# EAGLE design lipo (EAGLE 5.11)
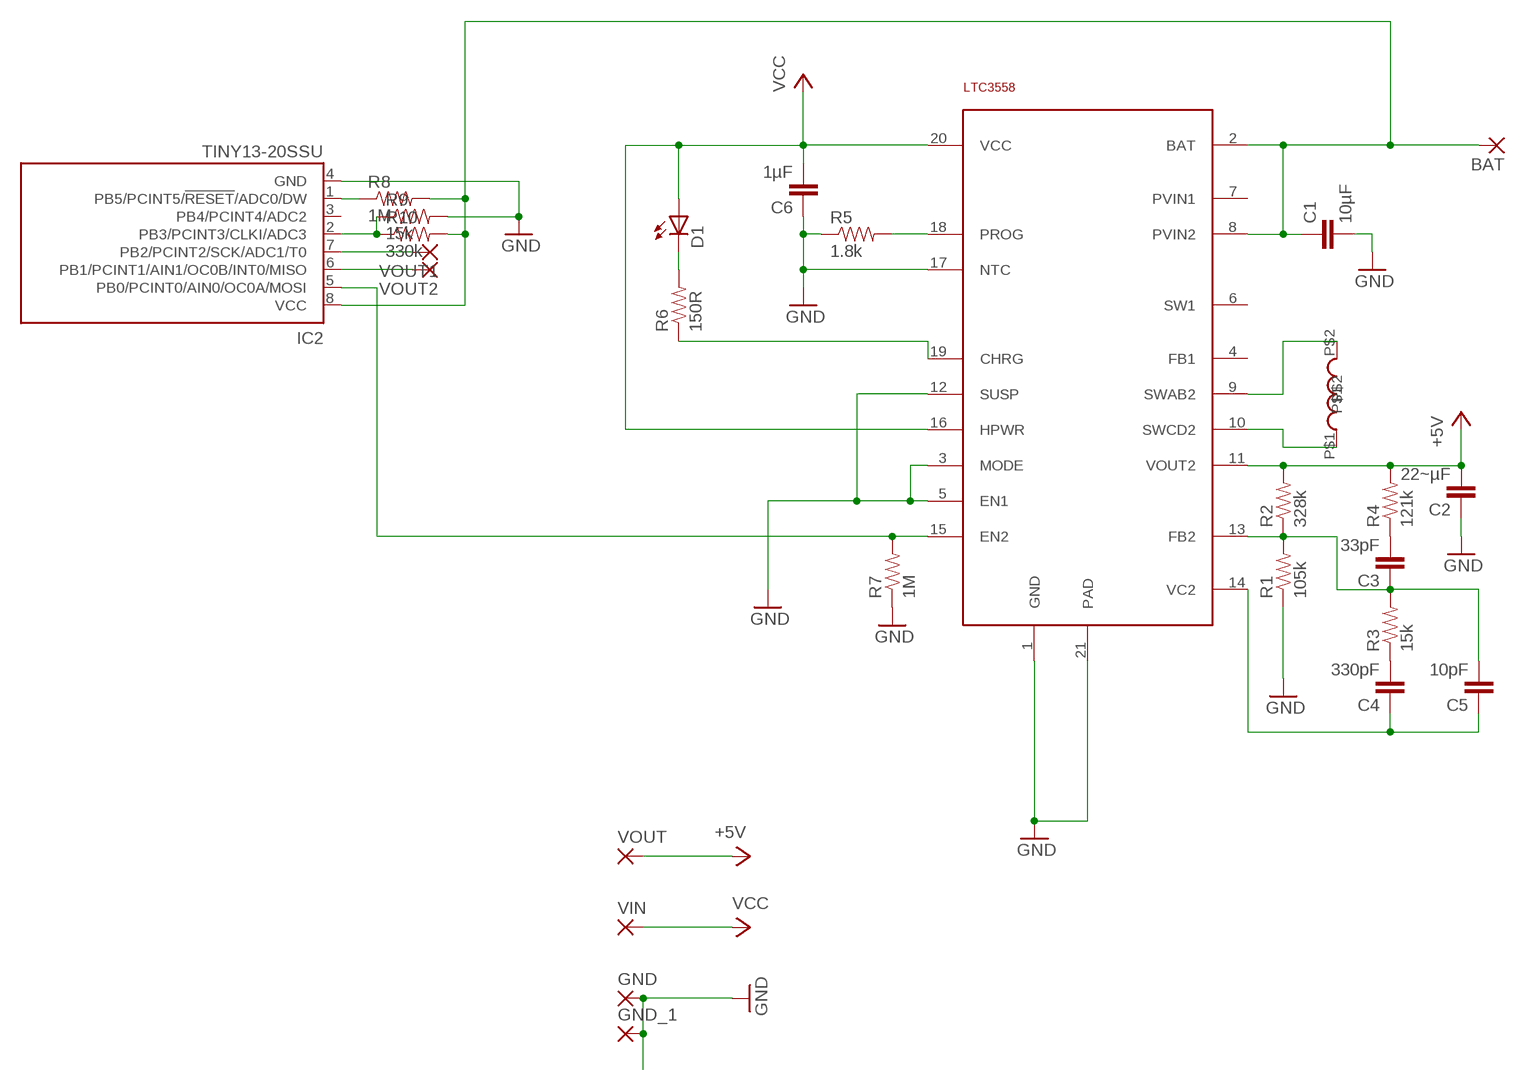
[diagram p0: schematic, sheet 1]

## Parts
BAT  SMD5  [SMD2,54-5,08]
C1  10µF  CAP0805  [0805]
C2  22~µF  CAP0805  [0805]
C3  33pF  CAP0805  [0805]
C4  330pF  CAP0805  [0805]
C5  10pF  CAP0805  [0805]
C6  1µF  CAP0805  [0805]
D1  LEDCHIPLED_0805  [CHIPLED_0805]
GND  SMD5  [SMD2,54-5,08]
GND_1  SMD5  [SMD2,54-5,08]
IC1  LTC3558  [UD-QFN20]
IC2  TINY13-20SSU  [8S1]
L1  2,2µH  SMD-INDUCTOR-4012  [SMD4012]
R1  105k  RESISTOR  [0805]
R2  328k  RESISTOR  [0805]
R3  15k  RESISTOR  [0805]
R4  121k  RESISTOR  [0805]
R5  1.8k  RESISTOR  [0805]
R6  150R  RESISTOR  [0805]
R7  1M  RESISTOR  [0805]
R8  1M  RESISTOR  [0805]
R9  15k  RESISTOR  [0805]
R10  330k  RESISTOR  [0805]
VIN  SMD5  [SMD2,54-5,08]
VOUT  SMD5  [SMD2,54-5,08]
VOUT1  SMD5  [SMD2,54-5,08]
VOUT2  SMD5  [SMD2,54-5,08]

## Nets
+5V: C2.2 IC1.11(VOUT2) R2.2 R4.2 VOUT.1(P)
GND: C1.2 C2.1 C6.1 GND.1(P) GND_1.1(P) IC1.1(GND) IC1.3(MODE) IC1.5(EN1) IC1.12(SUSP) IC1.17(NTC) IC1.21(PAD) IC2.4(GND) R1.1 R5.1 R7.1 R9.2
N$1: C3.1 C5.2 IC1.13(FB2) R1.2 R2.1 R3.2
N$2: D1.C R6.2
N$3: IC1.18(PROG) R5.2
N$4: C3.2 R4.1
N$5: C4.2 R3.1
N$6: C4.1 C5.1 IC1.14(VC2)
N$7: IC1.15(EN2) IC2.5(PB0/PCINT0/AIN0/OC0A/MOSI) R7.2
N$8: IC1.10(SWCD2) L1.P$1
N$9: IC1.9(SWAB2) L1.P$2
N$10: IC1.19(CHRG) R6.1
N$11: BAT.1(P) C1.1 IC1.2(BAT) IC1.8(PVIN2) IC2.8(VCC) R8.2 R10.2
N$12: IC2.2(PB3/PCINT3/CLKI/ADC3) R9.1 R10.1
N$13: IC2.1(PB5/PCINT5/!RESET!/ADC0/DW) R8.1
N$14: IC2.7(PB2/PCINT2/SCK/ADC1/T0) VOUT1.1(P)
N$15: IC2.6(PB1/PCINT1/AIN1/OC0B/INT0/MISO) VOUT2.1(P)
VCC: C6.2 D1.A IC1.16(HPWR) IC1.20(VCC) VIN.1(P)
Unconnected: IC1.4(FB1) IC1.6(SW1) IC1.7(PVIN1) IC2.3(PB4/PCINT4/ADC2)

## Library data of the parts
BAT GND GND_1 VIN VOUT VOUT1 VOUT2 = wirepad:SMD5: SMD PAD
C1-C6 = SparkFun:CAP: Capacitor Standard 0603 ceramic capacitor, and 0.1" leaded capacitor.
D1 = led:LED: LED OSRAM: - CHIPLED LG R971, LG N971, LY N971, LG Q971, LY Q971, LO R971, LY R971 LH N974, LH R974 LS Q976, LO Q976, LY Q976 LO Q996 - Hyper CHIPLED LW Q18S LB Q993, LB Q99A, LB R99A - SideLED LS A670, LO A670, LY A670, LG A670, LP A670 LB A673, LV A673, LT A673, LW A673 LH A674 LY A675 LS A676, LA A676, LO A676, LY A676, LW A676 LS A679, LY A679, LG A679 - Hyper Micro SIDELED® LS Y876, LA Y876, LO Y876, LY Y876 LT Y87S - SmartLED LW L88C, LW L88S LB L89C, LB L89S, LG L890 LS L89K, LO L89K, LY L89K LS L896, LA L896, LO L896, LY L896 - TOPLED LS T670, LO T670, LY T670, LG T670, LP T670 LSG T670, LSP T670, LSY T670, LOP T670, LYG T670 LG T671, LOG T671, LSG T671 LB T673, LV T673, LT T673, LW T673 LH T674 LS T676, LA T676, LO T676, LY T676, LB T676, LH T676, LSB T676, LW T676 LB T67C, LV T67C, LT T67C, LS T67K, LO T67K, LY T67K, LW E67C LS E67B, LA E67B, LO E67B, LY E67B, LB E67C, LV E67C, LT E67C LW T67C LS T679, LY T679, LG T679 LS T770, LO T770, LY T770, LG T770, LP T770 LB T773, LV T773, LT T773, LW T773 LH T774 LS E675, LA E675, LY E675, LS T675 LS T776, LA T776, LO T776, LY T776, LB T776 LHGB T686 LT T68C, LB T68C - Hyper Mini TOPLED® LB M676 - Mini TOPLED Santana® LG M470 LS M47K, LO M47K, LY M47K Source: http://www.osram.convergy.de LUXEON: - LUMILED® LXK2-PW12-R00, LXK2-PW12-S00, LXK2-PW14-U00, LXK2-PW14-V00 LXK2-PM12-R00, LXK2-PM12-S00, LXK2-PM14-U00 LXK2-PE12-Q00, LXK2-PE12-R00, LXK2-PE12-S00, LXK2-PE14-T00, LXK2-PE14-U00 LXK2-PB12-K00, LXK2-PB12-L00, LXK2-PB12-M00, LXK2-PB14-N00, LXK2-PB14-P00, LXK2-PB14-Q00 LXK2-PR12-L00, LXK2-PR12-M00, LXK2-PR14-Q00, LXK2-PR14-R00 LXK2-PD12-Q00, LXK2-PD12-R00, LXK2-PD12-S00 LXK2-PH12-R00, LXK2-PH12-S00 LXK2-PL12-P00, LXK2-PL12-Q00, LXK2-PL12-R00 Source: www.luxeon.com KINGBRIGHT: KA-3528ASYC Source: www.kingbright.com
IC1 = seb:LTC3558
IC2 = atmel:TINY13: 8-bit AVR Microcontroller with 1K Bytes In-System Programmable Flash Source: http://www.atmel.com/dyn/resources/prod_documents/2535S.pdf; MPN: ATTINY13-20SSU; OC_FARNELL: 1455133; OC_NEWARK: 58M3771
L1 = seb:SMD-INDUCTOR-4012
R1-R10 = SparkFun:RESISTOR: Resistor Basic schematic elements and footprints for 0603, 1206, and PTH 1/10th watt (small) resistors.

## Board
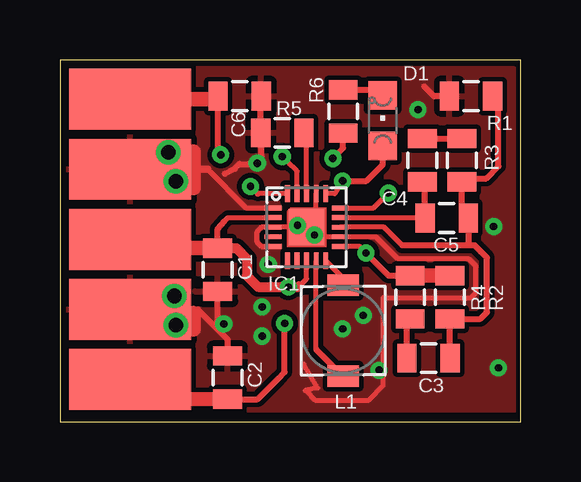
[diagram p1: board, top side]
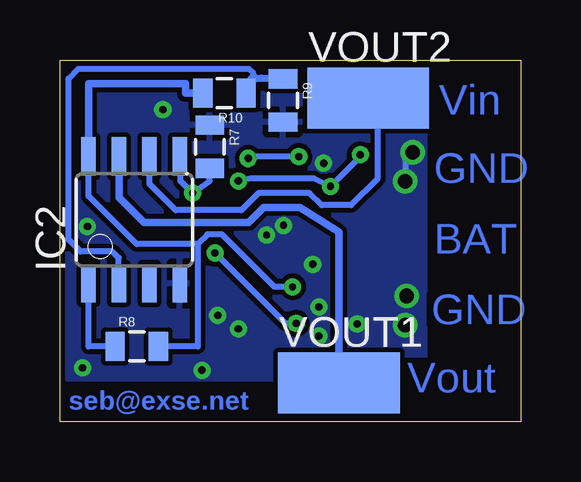
[diagram p2: board, bottom side, seen from below]

Size 19.23 x 15.1 mm. Coordinates in mm from the lower left corner, seen from the top.
Outline: 0,0 19.23,0 19.23,15.1 0,15.1 0,0
Copper layers (1*16): Top 0.035mm / dielectric 1.5mm / Bottom 0.035mm
Design rules "default *": minimum track width 0.2mm, minimum drill 0.3mm, track to track 0.2mm, track to pad 0.2mm, pad to pad 0.2mm, via to via 0.2mm, smd to smd 0.2mm, copper to edge 0.2mm, drill to drill 0.2mm, minimum pad ring 10mil, minimum via ring 8mil, stop-mask expansion 4mil, vias tented up to drill 100mil, thermal gap 10mil

### Footprints (pad centres in the part's own frame; a part is rotated, then mirrored left to right if it is on the bottom)
SMD2,54-5,08 = smd 2.54 x 5.08: 1 0,0
0805 = smd 0.8 x 1.2: 1 -0.9,0; 2 0.9,0
CHIPLED_0805 = smd 1.2 x 1.2: A 0,-1.05; C 0,1.05
UD-QFN20 = smd 0.7 x 0.2: 1 -1.4,0.8; 2 -1.4,0.4; 3 -1.4,0; 4 -1.4,-0.4; 5 -1.4,-0.8; 11 1.4,-0.8; 12 1.4,-0.4; 13 1.4,0; 14 1.4,0.4; 15 1.4,0.8 | smd 0.2 x 0.7: 6 -0.8,-1.4; 7 -0.4,-1.4; 8 0,-1.4; 9 0.4,-1.4; 10 0.8,-1.4; 16 0.8,1.4; 17 0.4,1.4; 18 0,1.4; 19 -0.4,1.4; 20 -0.8,1.4 | smd 1.5 x 1.5: 21 0,0
8S1 = smd 0.6 x 1.6: 1 -1.905,-2.654; 2 -0.645,-2.654; 3 0.625,-2.654; 4 1.895,-2.654; 5 1.905,2.654; 6 0.635,2.654; 7 -0.635,2.654; 8 -1.905,2.654
SMD4012 = smd 0.9 x 1.3: P$1 -1.9,0; P$2 1.9,0

### Placement (x,y rotation side)
BAT  2.92,7.62 90 top
C1  6.58,6.35 270 top
C2  6.99,1.85 270 top
C3  15.37,2.67 180 top
C4  15.11,10.92 90 top
C5  16.13,8.51 0 top
C6  7.49,13.59 180 top
D1  13.46,12.57 0 top
GND  2.92,10.54 90 top
GND_1  2.92,4.7 90 top
IC1  10.29,8.13 0 top
IC2  16.13,8.43 0 bottom
L1  11.81,3.81 270 top
R1  17.14,13.59 0 top
R2  16.26,5.21 90 top
R3  16.76,10.92 270 top
R4  14.61,5.21 90 top
R5  9.27,12.07 0 top
R6  11.81,12.95 90 top
R7  12.98,11.48 270 bottom
R8  16.03,3.15 0 bottom
R9  9.93,13.41 270 bottom
R10  12.37,13.72 180 bottom
VIN  2.92,13.46 90 top
VOUT  2.92,1.78 270 top
VOUT1  7.59,1.63 270 bottom
VOUT2  6.38,13.51 270 bottom

### Tracks (layer width: path | path; a pad name or v marks a point on that pad's centre or on a via)
+5V  (via drill 0.3 pad 0.3)
  Top 0.203: 13.08,6.73 12.48,7.33 IC1.11
  Top 0.254: 13.08,6.73 v12.76,7.05 13.71,6.11 R4.2 | v9.37,4.12 9.37,2.08 9.12,1.83 8.24,0.95 C2.2
  Top 0.61: VOUT.1 3.12,0.98 C2.2 | R4.2 R2.2
  Bottom 0.254: v9.37,4.12 9.83,4.12 v12.76,7.05
GND  (via drill 0.3 pad 0.3, 0.61 pad 0.3)
  Top 0.203: 10.29,7.73 IC1.12 13.18,7.73 14.1,6.81 17.04,6.81 17.35,6.5 17.35,5.38 17.14,5.18 13.49,5.18 13.49,1.52 12.88,0.91 10.64,0.91 10.24,1.32 10.74,1.42 10.16,2.41 | IC1.1 7.76,8.93 6.15,10.54 | IC1.5 8.39,7.33 8.2,7.52 8.2,7.92 8.41,8.13 IC1.3 IC1.21 10.69,8.53 IC1.17 | GND.1 5.26,10.54
  Top 0.254: R5.1 8.26,11.95 | R5.1 8.37,13.59 C6.1 | 10.29,7.73 IC1.21 | 5.26,10.54 5.23,10.54 v4.52,11.25 | R5.1 8.41,12.03 8.41,11.07 8.1,10.77 7.49,10.77 7.29,10.57 6.88,10.36 | R1.1 15.6,13.59 15.19,14 | C2.1 6.99,3.45 6.58,3.86 | 6.58,3.86 C1.2 | 6.58,3.86 5.74,4.7 5.56,4.7 GND_1.1
  Top 0.305: 5.26,10.54 6.15,10.54 | 5.56,9.75 5.28,10.03 v4.83,10.03 | 5.56,4.7 5.56,4.47
  Top 0.61: 5.56,4.47 5.56,3.86 | 5.56,9.75 5.56,11.28
  Bottom 0.254: v4.83,10.03 4.83,10.95 v4.52,11.25
  other vias: 4.78,5.26 11.79,3.89 6.83,4.09 4.83,4.04 9.91,8.2 10.62,7.8 12.65,4.45 8.69,6.58 14.94,13.03 8.23,10.8 8.43,4.8 18.29,2.26 8.43,3.58 13.31,2.16 18.08,8.15
  pour Top: 0.38,14.73 18.92,14.73 18.92,0.51 0.38,0.51
  pour Bottom: 4.04,14.73 4.04,1.8 18.92,1.8 18.92,14.73
N$1
  Top 0.203: IC1.13 13.51,8.13 14.28,7.37
  Top 0.254: R3.2 16.75,10.02 | R3.2 16.76,8.76 C5.2 17.16,8.38 17.04,8.27 17.04,7.37 | C3.1 16.27,4.3 R2.1 17.54,4.31 17.8,4.57 17.8,6.86 17.55,7.11 17.3,7.37 17.04,7.37 | R1.2 18.3,13.2 18.29,13.21 18.29,10.67 17.78,10.16 16.9,10.16 R3.2 | 14.28,7.37 16.89,7.37 17.04,7.37
N$2
  Top 0.254: D1.C 13.46,13.85 R6.2
N$3
  Top 0.203: IC1.18 10.29,11.95 R5.2
N$4
  Top 0.254: C3.2 14.47,4.3 R4.1
N$5
  Top 0.254: C4.2 R3.1
N$6
  Top 0.203: IC1.14 15.21,8.53
  Top 0.254: 15.21,8.53 C5.1 15.23,9.91 C4.1
N$7  (via drill 0.3)
  Top 0.203: IC1.15 13.07,8.93 v13.69,9.55
  Bottom 0.254: R7.2 12.98,10.06 v13.69,9.55 14.2,10.06 14.2,11.06 IC2.5
N$8
  Top 0.203: 11.81,6 IC1.10
  Top 0.254: L1.P$1 11.81,6
N$9
  Top 0.203: 10.69,3.03 IC1.9
  Top 0.254: L1.P$2 10.69,3.03
N$10  (via drill 0.3 pad 0.3)
  Top 0.203: IC1.19 9.89,10.46 9.47,10.87 v9.27,11.07
  Top 0.254: 11.56,12.05 R6.1 11.81,11.43 v11.38,11
  Bottom 0.254: v9.27,11.07 11.35,11.07 v11.38,11
N$11  (via drill 0.3)
  Top 0.203: IC1.8 10.29,5.97 9.96,5.64 | IC1.2 7,8.53 6.86,8.38
  Top 0.254: 7,7.25 C1.1 6.58,8.05 6.86,8.38 | 9.27,5.64 9.96,5.74 | 8.81,5.64 v9.53,5.64
  Top 0.406: 9.96,5.64 v9.53,5.64 9.27,5.64 8.81,5.64 8.26,5.64 7.8,6.1 7.8,6.81 7.36,7.25 C1.1
  Top 0.61: C1.1 3.29,7.25 BAT.1
  Bottom 0.254: R8.2 13.49,3.15 13.49,7.42 | 13.49,7.42 13.08,7.82 12.47,7.82 10.29,5.64 v9.53,5.64 | IC2.8 18.03,9.42 16.03,7.42 13.49,7.42
  Bottom 0.305: R10.2 14,13.72 14,14.12 18.03,14.12 IC2.8
N$12
  Bottom 0.254: IC2.2 16.77,6.84 17.04,7.11 18.36,7.11 18.87,7.62 18.87,14.33 18.47,14.73 11.35,14.73 11.17,14.54 R10.1
  Bottom 0.305: R10.1 11.27,14.31 10.83,14.34 R9.1
N$13
  Bottom 0.254: R8.1 18.03,3.15 IC2.1
N$14
  Bottom 0.305: IC2.7 16.76,9.37 15.72,8.33 11.35,8.33 10.74,8.94 9.22,8.94 7.6,7.92 7.6,6.4 VOUT1.1
N$15
  Bottom 0.254: IC2.6 15.49,9.93 14.4,8.84 11.66,8.84 10.95,9.55 8.81,9.55 8.31,9.04 7.09,9.04 5.97,10.16 5.97,13.21 VOUT2.1
VCC  (via drill 0.3 pad 0.3)
  Top 0.203: IC1.20 8.25,9.53 | IC1.16 11.46,9.53 v11.79,10.06
  Top 0.254: 8.25,9.53 v7.95,9.83 | v6.71,11.15 6.59,11.26 C6.2 | v11.79,10.06 12.78,10.06 13.46,10.74 D1.A
  Top 0.61: C6.2 6.59,13.46 VIN.1
  Bottom 0.254: v11.79,10.06 11.28,10.16 8.64,10.16 v7.95,9.83 6.71,11.07 v6.71,11.15

### Text on the board
Bottom: Vin | GND | BAT | GND | Vout | seb@exse.net